# Altium schematic sheet INDEX.SchDoc
size A4; SheetNumber: 1; SheetTotal: 9
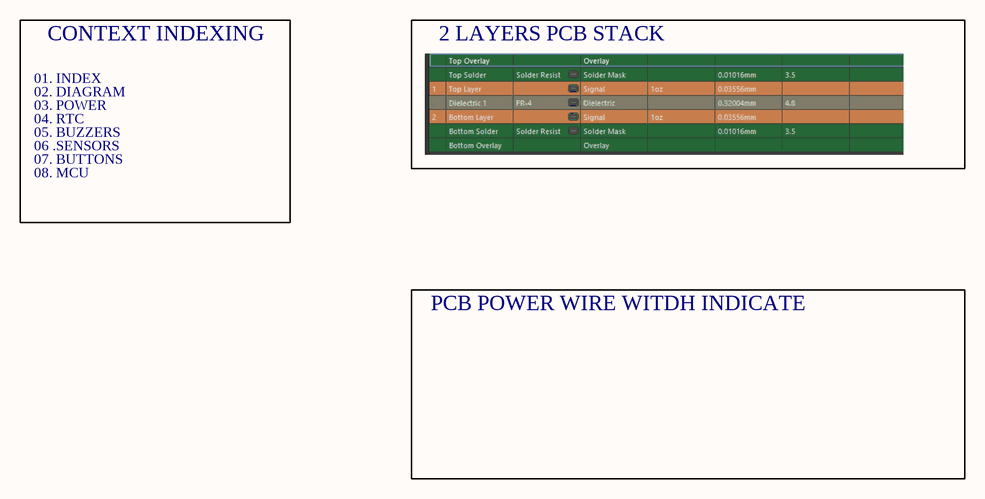
[diagram p0: INDEX.SchDoc]

## Notes on the sheet
- 01. INDEX
- CONTEXT INDEXING
- 2 LAYERS PCB STACK
- 02. DIAGRAM
- 03. POWER
- 04. RTC
- 05. BUZZERS
- 06 .SENSORS
- 07. BUTTONS
- 08. MCU
- PCB POWER WIRE WITDH INDICATE